# Altium schematic sheet Transcurrent.SchDoc: µtranscurrent
size A4; DrawnBy: Elektronenschubser; DocumentNumber: 1; Revision: 1.0; SheetNumber: 1; SheetTotal: 1; VersionControl_RevNumber: 1.0; DocumentFullPathAndName: µtranscurrent.SchDoc; ProjectName: µtranscurrent
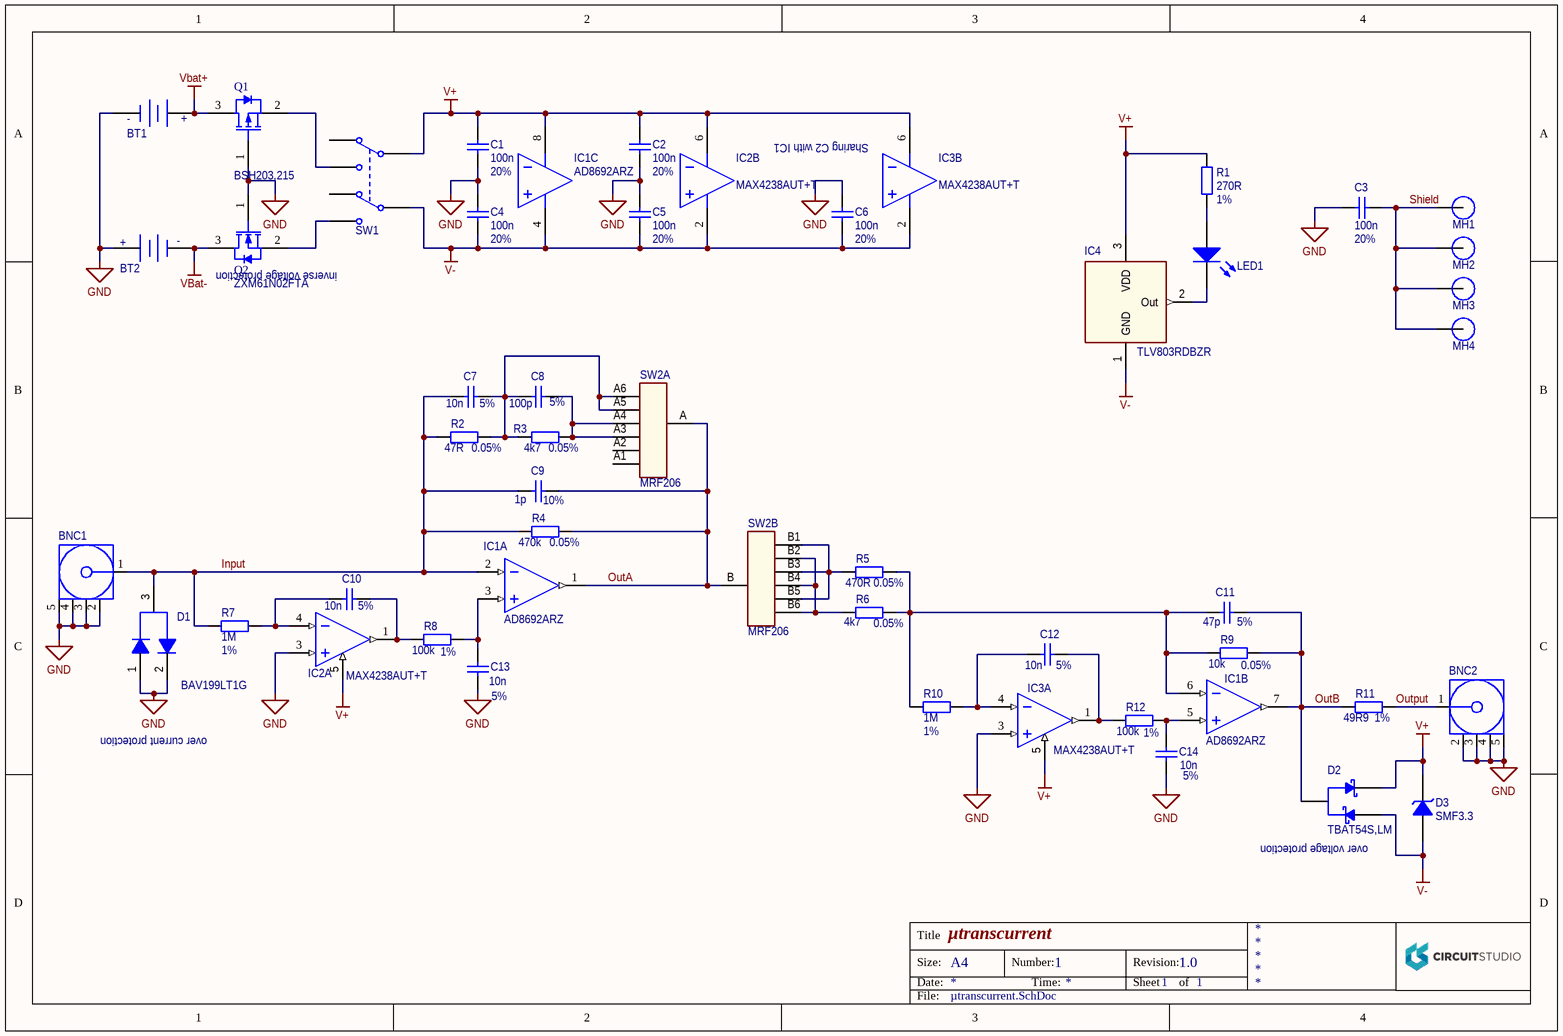
[diagram p0: Transcurrent.SchDoc]

## Parts
BNC1  BNC female angled  [BNC 90°]  (value not drawn)
BNC2  BNC female angled  [BNC 90°]  (value not drawn)
BT1  Battery  [Keystone1020]  (value not drawn)
BT2  Battery  [Keystone1020]  (value not drawn)
C1  value 100n  Tolerance: 20%  [C0805]  (hidden comment: Cap 100n 0805)
C2  value 100n  Tolerance: 20%  [C0805]  (hidden comment: Cap 100n 0805)
C3  value 100n  Tolerance: 20%  [C0805]  (hidden comment: Cap 100n 0805)
C4  value 100n  Tolerance: 20%  [C0805]  (hidden comment: Cap 100n 0805)
C5  value 100n  Tolerance: 20%  [C0805]  (hidden comment: Cap 100n 0805)
C6  value 100n  Tolerance: 20%  [C0805]  (hidden comment: Cap 100n 0805)
C7  value 10n  Tolerance: 5%  [C0805]  (hidden comment: C0805C103J5GACTU)
C8  value 100p  Tolerance: 5%  [C0805]  (hidden comment: CL21C101JC61PNC)
C9  value 1p  Tolerance: 10%  [C0805]  (hidden comment: CC0805BRNPO9BN1R0)
C10  value 10n  Tolerance: 5%  [C0805]  (hidden comment: C0805C103J5GACTU)
C11  value 47p  Tolerance: 5%  [C0805]  (hidden comment: CC0805JRNPO9BN470)
C12  value 10n  Tolerance: 5%  [C0805]  (hidden comment: C0805C103J5GACTU)
C13  value 10n  Tolerance: 5%  [C0805]  (hidden comment: C0805C103J5GACTU)
C14  value 10n  Tolerance: 5%  [C0805]  (hidden comment: C0805C103J5GACTU)
D1  BAV199LT1G  [SOT23-3]
D2  MPN: TBAT54S,LM  [SOT23-3]  (hidden comment: TBAT54S)
D3  D Zener  [SOD 123-FL]  (value not drawn)
IC1  AD8692ARZ  [SO8_N]  (parts A,B,C of 3)
IC2  MAX4238AUT+T  [SOT23-6]  (parts A,B of 2)
IC3  MAX4238AUT+T  [SOT23-6]  (parts A,B of 2)
IC4  TLV803RDBZR  [SOT23-3]
LED1  LED  [LED_1206_revers]  (value not drawn)
MH1  Mounting Hole M3.5  [M3.5 DIN84]  (value not drawn)  (no BOM)
MH2  Mounting Hole M3.5  [M3.5 DIN84]  (value not drawn)  (no BOM)
MH3  Mounting Hole M3.5  [M3.5 DIN84]  (value not drawn)  (no BOM)
MH4  Mounting Hole M3.5  [M3.5 DIN84]  (value not drawn)  (no BOM)
Q1  BSH203,215  [SOT23-3]
Q2  ZXM61N02FTA  [SOT23-3]
R1  value 270R  Tolerance: 1%  [R0805]  (hidden comment: Res 270R 0805)
R2  value 47R  Tolerance: 0.05%  [R0805]  (hidden comment: RG20N47WCT-ND)
R3  value 4k7  Tolerance: 0.05%  [R0805]  (hidden comment: Res2)
R4  value 470k  Tolerance: 0.05%  [R0805]  (hidden comment: RG2012N-474-W-T1)
R5  value 470R  Tolerance: 0.05%  [R0805]  (hidden comment: RG2012N-471-W-T1)
R6  value 4k7  Tolerance: 0.05%  [R0805]  (hidden comment: Res2)
R7  value 1M  Tolerance: 1%  [R0805]  (hidden comment: Res 1M 0805)
R8  value 100k  Tolerance: 1%  [R0805]  (hidden comment: Res 100k 0805)
R9  value 10k  Tolerance: 0.05%  [R0805]  (hidden comment: RG20N10.0KWCT-ND)
R10  value 1M  Tolerance: 1%  [R0805]  (hidden comment: Res 1M 0805)
R11  value 49R9  Tolerance: 1%  [R0805]  (hidden comment: Res 49R9 0805)
R12  value 100k  Tolerance: 1%  [R0805]  (hidden comment: Res 100k 0805)
SW1  MMP 221  [MMP 221]  (value not drawn)
SW2  MRF206  [MKF206]  (parts A,B of 2)

## Nets
GND: BNC1.2(GND) BNC1.3(GND) BNC1.4(GND) BNC1.5(GND) BNC2.2(GND) BNC2.3(GND) BNC2.4(GND) BNC2.5(GND) BT1.1(-) BT2.2(+) C1.1 C2.1 C3.1 C4.2 C5.2 C6.2 C13.1 C14.1 D1.1 D1.2 IC2.3(IN+) IC3.3(IN+) Q1.1(G) Q2.1(G)
V+: C1.2 C2.2 D2.2 D3.2(K) IC1.8(V+) IC2.5(~{SHDN}) IC2.6(V+) IC3.5(~{SHDN}) IC3.6(V+) IC4.3(VDD) R1.2 SW1.2(COMMON1)
V-: C4.1 C5.1 C6.1 D2.1 D3.1(A) IC1.4(V-) IC2.2(V-) IC3.2(V-) IC4.1(GND) SW1.5(COMMON2)
Vbat+: BT1.2(+) Q1.3(D)
VBat-: BT2.1(-) Q2.3(D)
Input: BNC1.1(Signal) C7.1 C9.1 D1.3 IC1.2(INA-) R2.1 R4.1 R7.1
OutA: C9.2 IC1.1(OUTA) R4.2 SW2.A SW2.B
OutB: C11.2 D2.3 IC1.7(OUTB) R9.2 R11.1
Output: BNC2.1(Signal) R11.2
Shield: C3.2 MH1.0 MH2.0 MH3.0 MH4.0
NetC7_2: C7.2 C8.1 R2.2 R3.1 SW2.A5 SW2.A6
NetC8_2: C8.2 R3.2 SW2.A3 SW2.A4
NetC10_1: C10.1 IC2.4(IN-) R7.2
NetC10_2: C10.2 IC2.1(OUT) R8.1
NetC11_1: C11.1 IC1.6(INB-) R5.2 R6.2 R9.1 R10.1
NetC12_1: C12.1 IC3.4(IN-) R10.2
NetC12_2: C12.2 IC3.1(OUT) R12.1
NetC13_2: C13.2 IC1.3(INA+) R8.2
NetC14_2: C14.2 IC1.5(INB+) R12.2
NetIC4_2: IC4.2(Out) LED1.2(K)
NetLED1_1: LED1.1(A) R1.1
NetQ1_2: Q1.2(S) SW1.3(NO1)
NetQ2_2: Q2.2(S) SW1.6(NO2)
NetR5_1: R5.1 SW2.B1 SW2.B3 SW2.B5
NetR6_1: R6.1 SW2.B2 SW2.B4 SW2.B6

Not connected (* = marked no-connect by the designer): SW1 1(NC1) 4(NC2); SW2 A1 A2

## Notes on the sheet
- Sharing C2 with IC1
- inverse voltage protection
- over current protection
- (near D2) over voltage protection
- Title
- Size:
- Date:
- A4
- Number:
- Time:
- Revision:
- Sheet
- of
- File:

## Library data of the parts
BNC1 BNC2 = J01001A1948: Connector, BNC THT 50R angled; Manufacturer: Telegärtner; MPN: J01001A1948; Supplier1: Völkner; Supplier1 Partnumber: V076191
BT1 BT2 = Keystone1020: BATTERY HOLDER AAA SMD TAB; Manufacturer: Keystone Electronics; MPN: 1020; Supplier1: Digikey; Supplier1 Partnumber: 36-1020-ND
C1-C6 = C0805_100n: Capacitor 100n 20% 0805; Manufacturer: Any; Supplier1: Any
C7 C10 C12-C14 = C0805C103J5GACTU: CAP CER 10nF 50V C0G/NP0 0805; Manufacturer: Kemet; MPN: C0805C103J5GACTU; Supplier1 Partnumber: 399-7992-1-ND; Supplier1: Digikey
C8 = CL21C101JC61PNC: CAP CER 100PF 100V C0G/NP0 0805; Manufacturer: Samsung; MPN: CL21C101JC61PNC; Supplier1 Partnumber: 1276-2569-1-ND; Supplier1: Digikey
C9 = CC0805BRNPO9BN1R0: CAP CER 1PF 50V NPO 0805; Manufacturer: Yageo; MPN: CC0805BRNPO9BN1R0; Supplier1 Partnumber: 311-4124-1-ND; Supplier1: Digikey
C11 = CC0805JRNPO9BN470: CAP CER 47PF 50V C0G/NPO 0805; Manufacturer: Yageo; MPN: CC0805JRNPO9BN470; Supplier1 Partnumber: 311-1107-1-ND; Supplier1: Digikey
D1 = BAV199LT1G: DIODE ARRAY GP 70V 215MA SOT23-3; Manufacturer: ON Semiconductor; Supplier1: Digikey; Supplier1 Partnumber: BAV199LT1GOSCT-ND; MPN: BAV199LT1G
D2 = TBAT54S: DIODE SCHOTTKY 30V 140MA SOT23; Manufacturer: Toshiba; Supplier1 Partnumber: TBAT54SLMCT-ND; Supplier1: Digikey
D3 = SMF3.3: TVS DIODE 3.3V 6.8V SOD123FL; Manufacturer: Littelfuse Inc.; Supplier1: Digikey; Supplier1 Partnumber: F7701CT-ND; MPN: SMF3.3
IC1 = AD8692ARZ: IC OPAMP GP 10MHZ RRO 8SOIC; Manufacturer: Analog Devices; Supplier1: Digikey; Supplier1 Partnumber: AD8692ARZ-REELCT-ND; MPN: AD8692ARZ
IC2 IC3 = MAX4238AUT+T: OpAmp, low noise, auto zero; Manufacturer: Maxim Integrated; Supplier1: Digikey; Supplier1 Partnumber: MAX4238AUT+TCT-ND; MPN: MAX4238AUT+T
IC4 = TLV803RDBZR: IC VOLT SUPERVISOR 2.64V SOT23-3; Manufacturer: Texas Instruments; MPN: TLV803RDBZR; Supplier1: Digikey; Supplier1 Partnumber: 296-29195-1-ND
LED1 = 156120RS75300: LED rot 1206 revers; Manufacturer: Würth Elektronik; Color: red; MPN: 156120RS75300; Supplier1: Digikey; Supplier1 Partnumber: 732-5031-1-ND
Q1 = BSH203,215: MOSFET P-CH 30V 470MA SOT23; Manufacturer: Nexperia; Supplier1 Partnumber: 1727-6216-1-ND; Supplier1: Digikey; MPN: BSH203,215
Q2 = ZXM61N02FTA: MOSFET N-CH 20V 1.7A SOT23-3; Manufacturer: Diodes Inc.; Supplier1: Digikey; Supplier1 Partnumber: ZXM61N02FCT-ND; MPN: ZXM61N02FTA
R1 = R0805_270R: Resistor 270R 1% 0805; Manufacturer: Any; Supplier1: Any
R2 = RG2012N-470-W-T1: RES SMD 47 OHM 0.05% 1/8W 0805; Manufacturer: Susumu; MPN: RG2012N-470-W-T1; Supplier1: Digikey; Supplier1 Partnumber: RG20N47WCT-ND
R3 R6 = ERA-6ARW472V: RES SMD 4k7 OHM 0.05% 1/8W 0805; Manufacturer: Panasonic; MPN: ERA-6ARW472V; Supplier1: Digikey; Supplier1 Partnumber: P4.7KBSCT-ND
R4 = RG2012N-474-W-T1: RES SMD 470K OHM 0.05% 1/8W 0805; Manufacturer: Susumu; MPN: RG2012N-474-W-T1; Supplier1: Digikey; Supplier1 Partnumber: RG20N470KWCT-ND
R5 = RG2012N-471-W-T1: RES SMD 470 OHM 0.05% 1/8W 0805; Manufacturer: Susumu; MPN: RG2012N-471-W-T1; Supplier1: Digikey; Supplier1 Partnumber: RG20N470WCT-ND
R7 R10 = R0805_1M: Resistor 1M 1% 0805; Manufacturer: Any; Supplier1: Any
R8 R12 = R0805_100k: Resistor 100k 1% 0805; Manufacturer: Any; Supplier1: Any
R9 = RG2012N-103-W-T1: RES SMD 10K OHM 0.05% 1/8W 0805; Manufacturer: Susumu; MPN: RG2012N-103-W-T1; Supplier1: Digikey; Supplier1 Partnumber: RG20N10.0KWCT-ND
R11 = R0805_49R9: Resistor 49R9 1% 0805; Manufacturer: Any; Supplier1: Any
SW1 = MMP 221: Switch, DPDT THT mini; Manufacturer: Knitterswitch; MPN: 221; Supplier1: Völkner; Supplier1 Partnumber: D73482
SW2 = MRF206: DP6T Rotary Switch; Manufacturer: NKK Switches; MPN: MRF206; Supplier2: Voelkner; Supplier2 Partnumber: D70253; Supplier1: Digikey; Supplier1 Partnumber: 360-2371-ND